# EAGLE design PIC32_BREAKOUT (EAGLE 7.5.0)
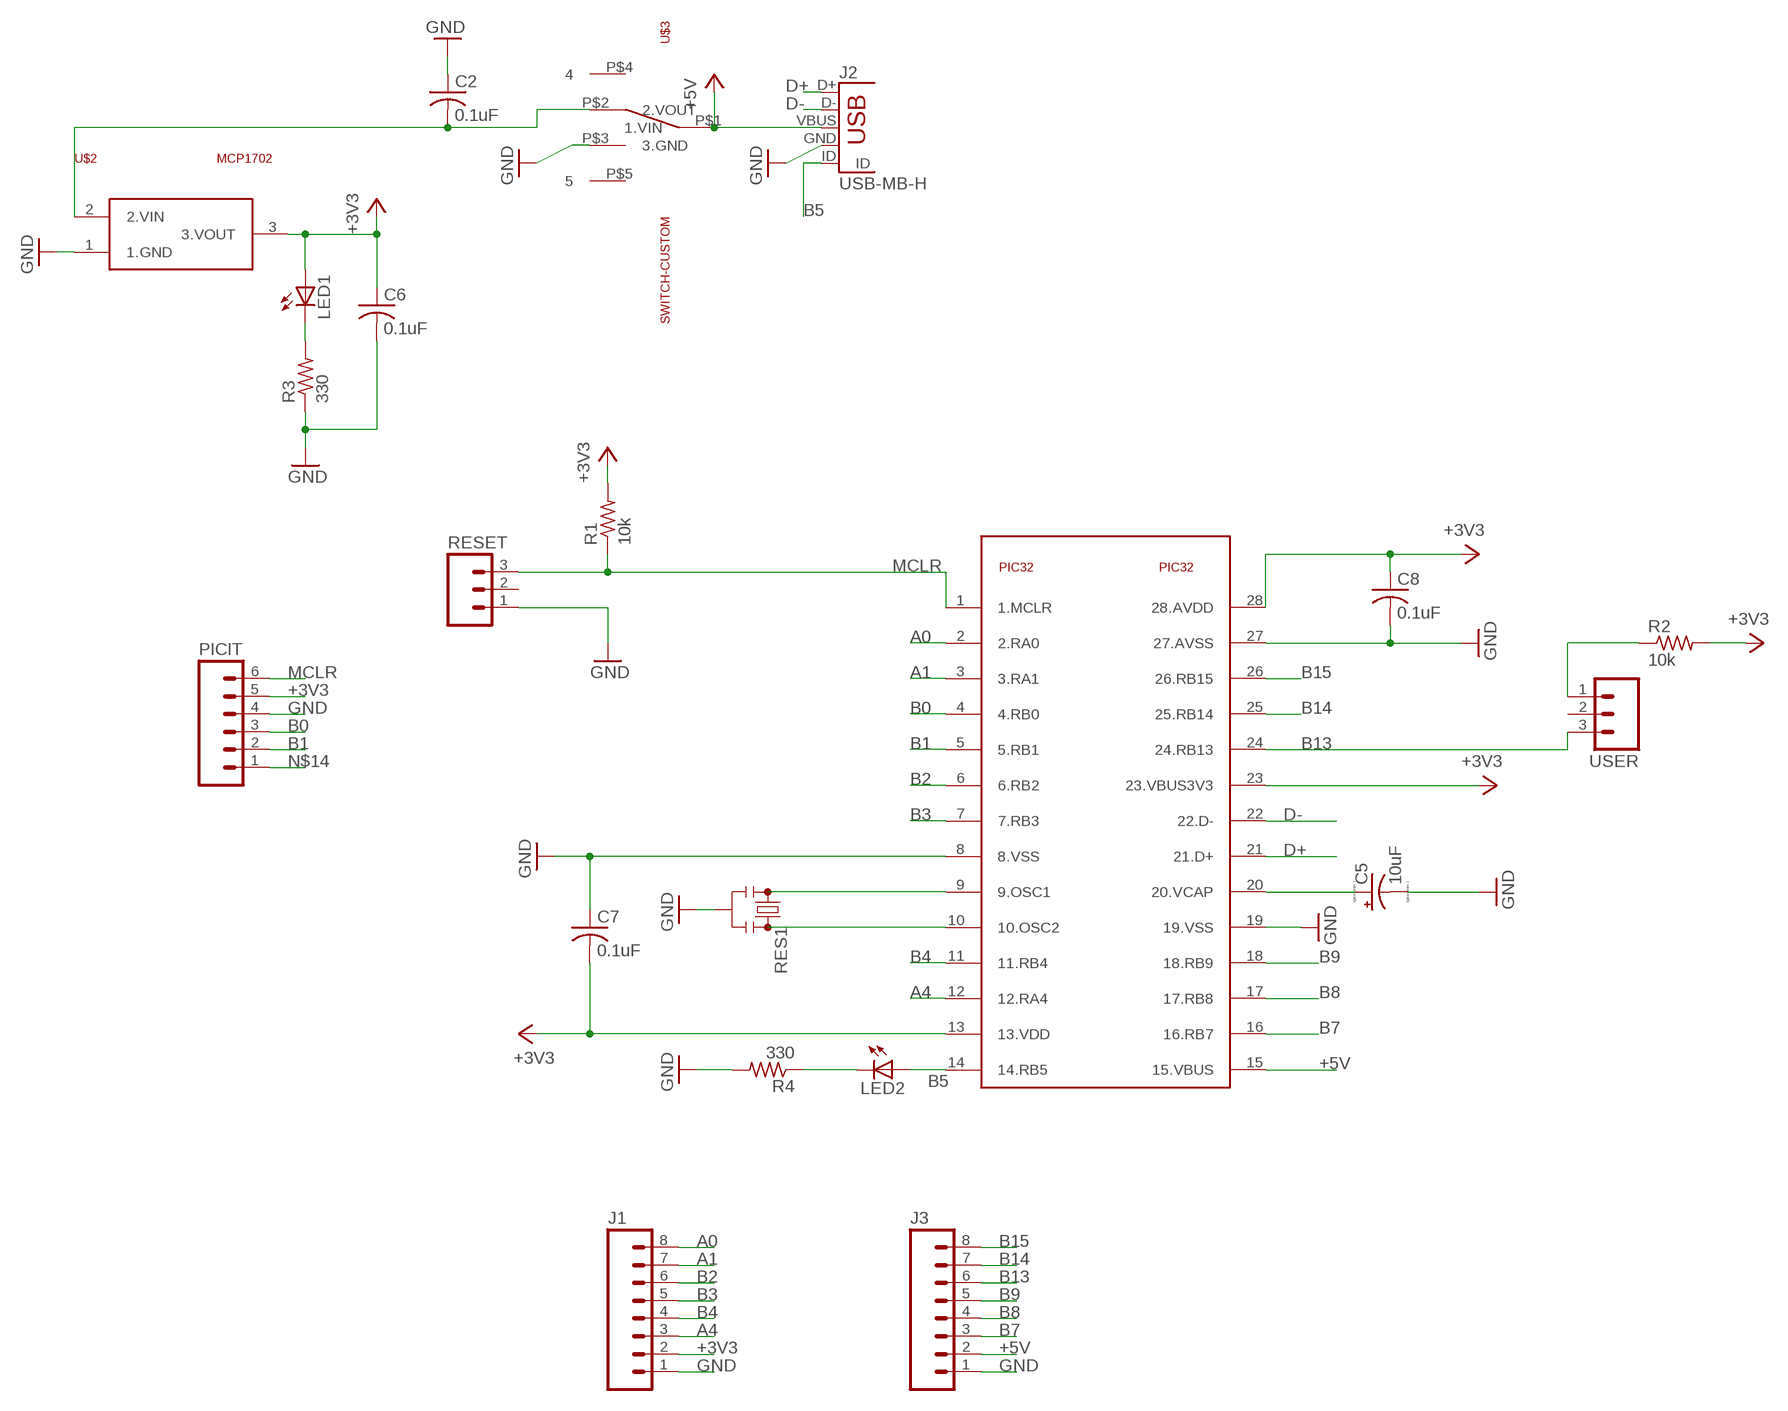
[diagram p0: schematic, sheet 1]

## Parts
C2  0.1uF  C-US025-024X044  [C025-024X044]
C5  10uF  CPOL-USB45181A  [B45181A]
C6  0.1uF  C-US025-024X044  [C025-024X044]
C7  0.1uF  C-US025-024X044  [C025-024X044]
C8  0.1uF  C-US025-024X044  [C025-024X044]
J1  M08  [1X08_ROUND]
J2  USB-MB-H  [USB-MB-H]
J3  M08  [1X08_ROUND]
LED1  LED3MM  [LED3MM]
LED2  LED3MM  [LED3MM]
PIC32  PIC32  [DIL28-3]
PICIT  M06SILK_FEMALE_PTH  [1X06]
R1  10k  R-US_0204/7  [0204/7]
R2  10k  R-US_0204/7  [0204/7]
R3  330  R-US_0204/7  [0204/7]
R4  330  R-US_0204/7  [0204/7]
RES1  RESONATORPTH  [RESONATOR-PTH]
RESET  M03LOCK  [1X03_LOCK]
U$2  MCP1702  [TO92]
U$3  SWITCH-CUSTOM  [SWITCH-CUS-H1]
USER  M03LOCK  [1X03_LOCK]

## Nets
+3V3: C6.1 C7.2 C8.1 J1.2 LED1.A PIC32.13(13.VDD) PIC32.23(23.VBUS3V3) PIC32.28(28.AVDD) PICIT.5 R1.2 R2.2 U$2.3(3.VOUT)
+5V: J2.VBUS J3.2 PIC32.15(15.VBUS) U$3.P$1(1.VIN)
A0: J1.8 PIC32.2(2.RA0)
A1: J1.7 PIC32.3(3.RA1)
A4: J1.3 PIC32.12(12.RA4)
B0: PIC32.4(4.RB0) PICIT.3
B1: PIC32.5(5.RB1) PICIT.2
B2: J1.6 PIC32.6(6.RB2)
B3: J1.5 PIC32.7(7.RB3)
B4: J1.4 PIC32.11(11.RB4)
B5: J2.ID LED2.A PIC32.14(14.RB5)
B7: J3.3 PIC32.16(16.RB7)
B8: J3.4 PIC32.17(17.RB8)
B9: J3.5 PIC32.18(18.RB9)
B13: J3.6 PIC32.24(24.RB13) USER.3
B14: J3.7 PIC32.25(25.RB14)
B15: J3.8 PIC32.26(26.RB15)
D+: J2.D+ PIC32.21(21.D+)
D-: J2.D- PIC32.22(22.D-)
GND: C2.1 C5.- C6.2 C7.1 C8.2 J1.1 J2.GND J3.1 PIC32.8(8.VSS) PIC32.19(19.VSS) PIC32.27(27.AVSS) PICIT.4 R3.1 R4.2 RES1.2 RESET.1 U$2.1(1.GND) U$3.P$3(3.GND)
MCLR: PIC32.1(1.MCLR) PICIT.6 R1.1 RESET.3
N$1: C5.+ PIC32.20(20.VCAP)
N$2: C2.2 U$2.2(2.VIN) U$3.P$2(2.VOUT)
N$3: LED1.K(C) R3.2
N$7: LED2.K(C) R4.1
N$9: PIC32.9(9.OSC1) RES1.1
N$10: PIC32.10(10.OSC2) RES1.3
N$14: PICIT.1
N$17: R2.1 USER.1
Unconnected: RESET.2 U$3.P$4 U$3.P$5 USER.2

## Library data of the parts
C2 C6-C8 = pic32_lib:C-US: CAPACITOR, American symbol
C5 = pic32_lib:CPOL-US: POLARIZED CAPACITOR, American symbol
J1 J3 = pic32_lib:M08: Header 8 Standard 8-pin 0.1" header. Use with straight break away headers (SKU : PRT-00116), right angle break away headers (PRT-00553), swiss pins (PRT-00743), machine pins (PRT-00117), and female headers (PRT-00115).; PROD_ID: CONN-08437
J2 = pic32_lib:USB: USB Connectors USB-B-PTH is fully proven SKU : PRT-00139/CONN-08278 USB-miniB is fully proven SKU : PRT-00587 USB-A-PCB is untested. USB-A-H is throughly reviewed, but untested. Spark Fun Electronics SKU : PRT-00437 USB-B-SMT is throughly reviewed, but untested. Needs silkscreen touching up. USB-A-S has not been used/tested USB-MB-H has not been used/tested USB-MICROB has been used. CONN-09505
LED1 LED2 = pic32_lib:LED: LED OSRAM: - CHIPLED LG R971, LG N971, LY N971, LG Q971, LY Q971, LO R971, LY R971 LH N974, LH R974 LS Q976, LO Q976, LY Q976 LO Q996 - Hyper CHIPLED LW Q18S LB Q993, LB Q99A, LB R99A - SideLED LS A670, LO A670, LY A670, LG A670, LP A670 LB A673, LV A673, LT A673, LW A673 LH A674 LY A675 LS A676, LA A676, LO A676, LY A676, LW A676 LS A679, LY A679, LG A679 - Hyper Micro SIDELED® LS Y876, LA Y876, LO Y876, LY Y876 LT Y87S - SmartLED LW L88C, LW L88S LB L89C, LB L89S, LG L890 LS L89K, LO L89K, LY L89K LS L896, LA L896, LO L896, LY L896 - TOPLED LS T670, LO T670, LY T670, LG T670, LP T670 LSG T670, LSP T670, LSY T670, LOP T670, LYG T670 LG T671, LOG T671, LSG T671 LB T673, LV T673, LT T673, LW T673 LH T674 LS T676, LA T676, LO T676, LY T676, LB T676, LH T676, LSB T676, LW T676 LB T67C, LV T67C, LT T67C, LS T67K, LO T67K, LY T67K, LW E67C LS E67B, LA E67B, LO E67B, LY E67B, LB E67C, LV E67C, LT E67C LW T67C LS T679, LY T679, LG T679 LS T770, LO T770, LY T770, LG T770, LP T770 LB T773, LV T773, LT T773, LW T773 LH T774 LS E675, LA E675, LY E675, LS T675 LS T776, LA T776, LO T776, LY T776, LB T776 LHGB T686 LT T68C, LB T68C - Hyper Mini TOPLED® LB M676 - Mini TOPLED Santana® LG M470 LS M47K, LO M47K, LY M47K Source: http://www.osram.convergy.de LUXEON: - LUMILED® LXK2-PW12-R00, LXK2-PW12-S00, LXK2-PW14-U00, LXK2-PW14-V00 LXK2-PM12-R00, LXK2-PM12-S00, LXK2-PM14-U00 LXK2-PE12-Q00, LXK2-PE12-R00, LXK2-PE12-S00, LXK2-PE14-T00, LXK2-PE14-U00 LXK2-PB12-K00, LXK2-PB12-L00, LXK2-PB12-M00, LXK2-PB14-N00, LXK2-PB14-P00, LXK2-PB14-Q00 LXK2-PR12-L00, LXK2-PR12-M00, LXK2-PR14-Q00, LXK2-PR14-R00 LXK2-PD12-Q00, LXK2-PD12-R00, LXK2-PD12-S00 LXK2-PH12-R00, LXK2-PH12-S00 LXK2-PL12-P00, LXK2-PL12-Q00, LXK2-PL12-R00 Source: www.luxeon.com KINGBRIGHT: KA-3528ASYC Source: www.kingbright.com
PIC32 = pic32_lib:PIC32
PICIT = pic32_lib:M06: Header 6 Standard 6-pin 0.1" header. Use with straight break away headers (SKU : PRT-00116), right angle break away headers (PRT-00553), swiss pins (PRT-00743), machine pins (PRT-00117), and female headers (PRT-00115). Molex polarized connector foot print use with SKU : PRT-08094 with associated crimp pins and housings. NOTES ON THE VARIANTS LOCK and LOCK_LONGPADS... This footprint was designed to help hold the alignment of a through-hole component (i.e. 6-pin header) while soldering it into place. You may notice that each hole has been shifted either up or down by 0.005 of an inch from it's more standard position (which is a perfectly straight line). This slight alteration caused the pins (the squares in the middle) to touch the edges of the holes. Because they are alternating, it causes a "brace" to hold the component in place. 0.005 has proven to be the perfect amount of "off-center" position when using our standard breakaway headers. Although looks a little odd when you look at the bare footprint, once you have a header in there, the alteration is very hard to notice. Also,if you push a header all the way into place, it is covered up entirely on the bottom side. This idea of altering the position of holes to aid alignment will be further integrated into the Sparkfun Library for other footprints. It can help hold any component with 3 or more connection pins.; PROD_ID: CONN-08437
R1-R4 = pic32_lib:R-US_: RESISTOR, American symbol
RES1 = SparkFun-FreqCtrl:RESONATOR: Resonator Small SMD resonator. Used, eg, on the Arduino Pro/ Pro Mini boards. 8MHz- XTAL-08895 16MHz- XTAL-08900
RESET USER = pic32_lib:M03: Header 3 Standard 3-pin 0.1" header. Use with straight break away headers (SKU : PRT-00116), right angle break away headers (PRT-00553), swiss pins (PRT-00743), machine pins (PRT-00117), and female headers (PRT-00115). Molex polarized connector foot print use with SKU : PRT-08232 with associated crimp pins and housings.
U$2 = pic32_lib:MCP1702
U$3 = pic32_lib:SWITCH-CUSTOM

## Board
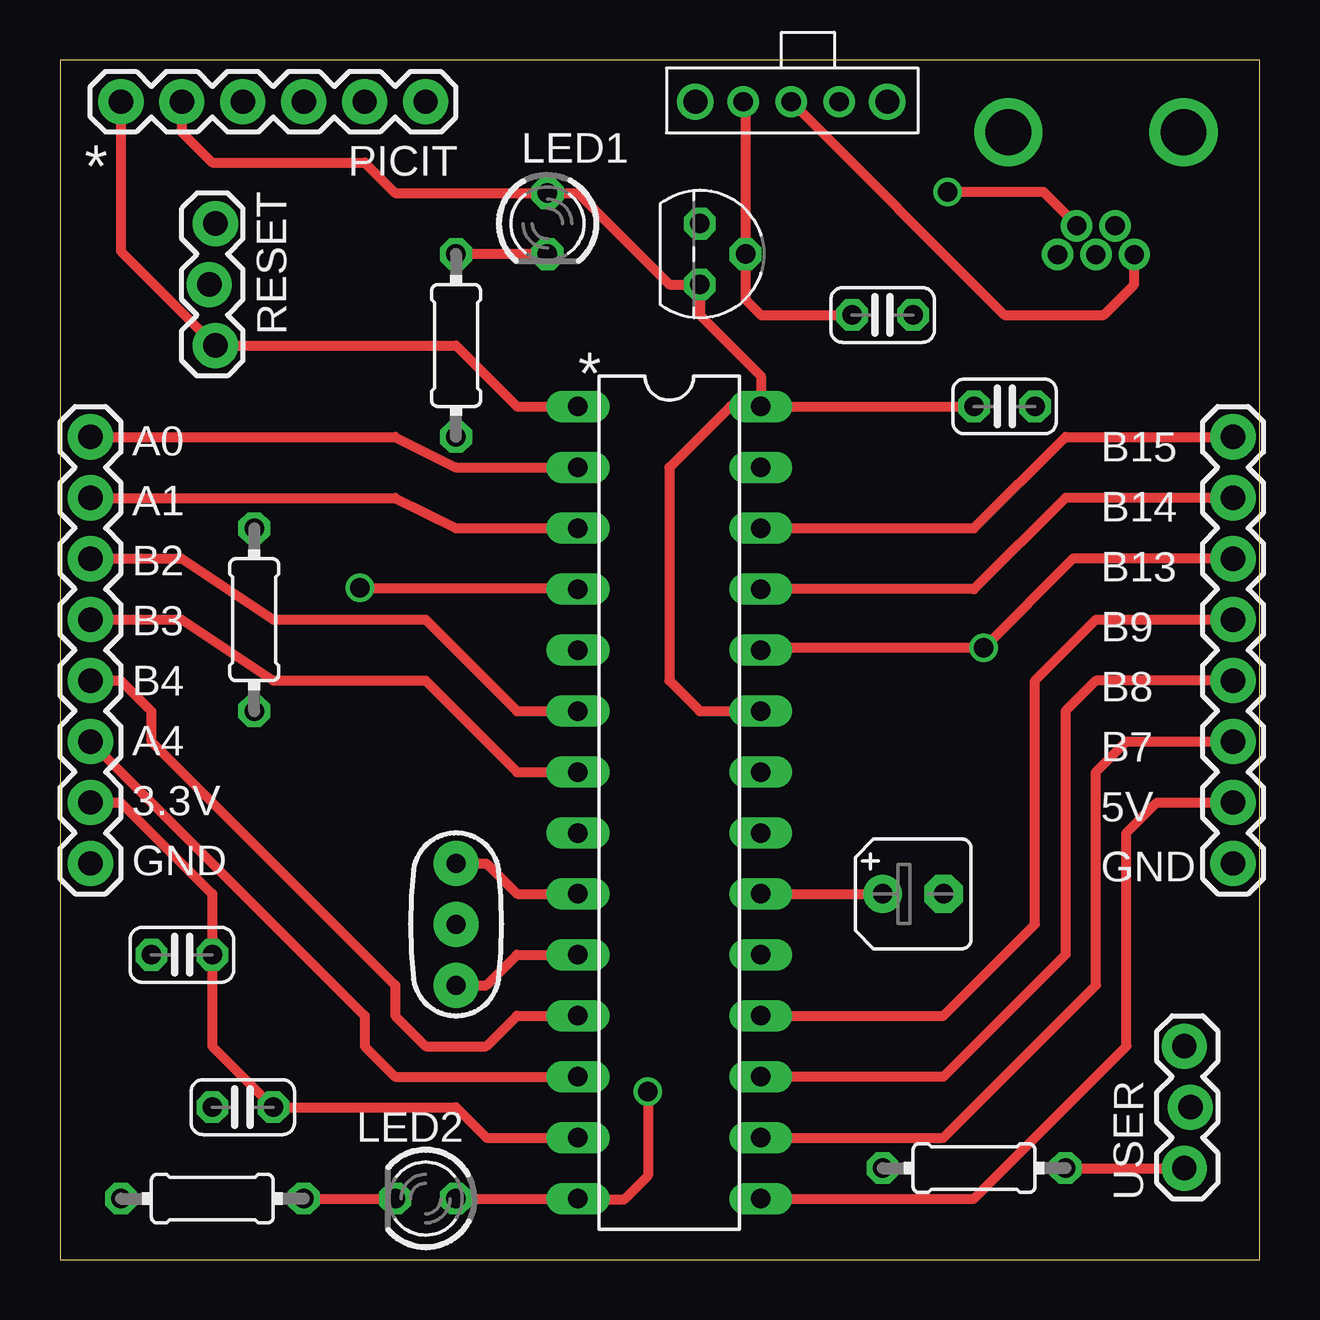
[diagram p1: board, top side]
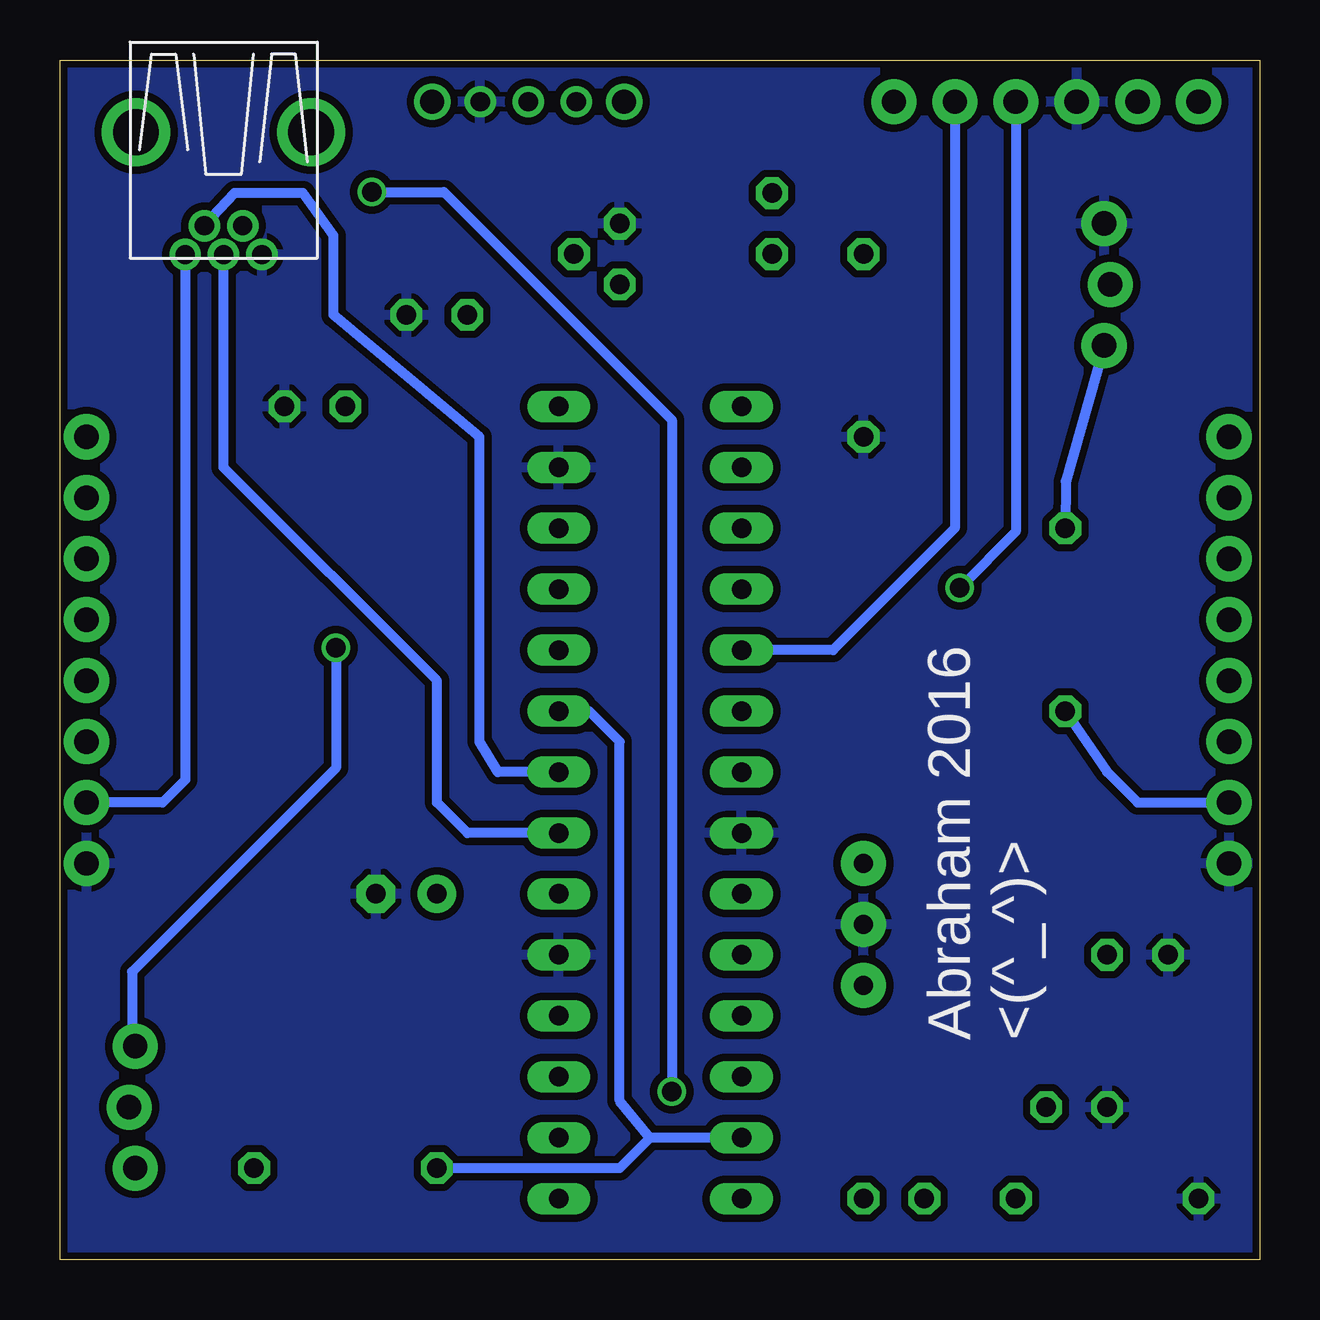
[diagram p2: board, bottom side, seen from below]

Size 50 x 50 mm. Coordinates in mm from the lower left corner, seen from the top.
Outline: 0,0 50,0 50,50 0,50 0,0
Copper layers (1*16): Top 0.035mm / dielectric 1.5mm / Bottom 0.035mm
Design rules "SeeedStudio_rule_no_angle_090911": minimum track width 6mil, minimum drill 12mil, track to track 6mil, track to pad 6mil, pad to pad 6mil, via to via 6mil, smd to smd 0mil, copper to edge 10mil, drill to drill 10mil, minimum pad ring 10mil, minimum via ring 6mil, stop-mask expansion 2mil, vias tented up to drill 100mil, thermal gap 10mil

### Footprints (pad centres in the part's own frame; a part is rotated, then mirrored left to right if it is on the bottom)
C025-024X044 = drill 0.813 octagon: 1 -1.27,0; 2 1.27,0
B45181A = drill 0.813 pad 1.6: + -1.27,0 | drill 0.813 pad 1.6 octagon: - 1.27,0
1X08_ROUND = drill 1.016 pad 1.88: 1 0,0; 2 2.54,0; 3 5.08,0; 4 7.62,0; 5 10.16,0; 6 12.7,0; 7 15.24,0; 8 17.78,0
USB-MB-H = drill 0.8: D+ 5.1,0; D- 3.9,0.8; GND 5.1,-1.6; ID 3.9,-0.8; VBUS 5.1,1.6 | drill 1.9: P$6 0,-3.65; P$7 0,3.65
LED3MM = drill 0.813 octagon: A -1.27,0; K 1.27,0
DIL28-3 = drill 0.813 long: 1 -16.51,-3.81; 2 -13.97,-3.81; 3 -11.43,-3.81; 4 -8.89,-3.81; 5 -6.35,-3.81; 6 -3.81,-3.81; 7 -1.27,-3.81; 8 1.27,-3.81; 9 3.81,-3.81; 10 6.35,-3.81; 11 8.89,-3.81; 12 11.43,-3.81; 13 13.97,-3.81; 14 16.51,-3.81; 15 16.51,3.81; 16 13.97,3.81; 17 11.43,3.81; 18 8.89,3.81; 19 6.35,3.81; 20 3.81,3.81; 21 1.27,3.81; 22 -1.27,3.81; 23 -3.81,3.81; 24 -6.35,3.81; 25 -8.89,3.81; 26 -11.43,3.81; 27 -13.97,3.81; 28 -16.51,3.81
1X06 = drill 1.016 pad 1.88: 1 0,0; 2 2.54,0; 3 5.08,0; 4 7.62,0; 5 10.16,0; 6 12.7,0
0204/7 = drill 0.813 octagon: 1 -3.81,0; 2 3.81,0
RESONATOR-PTH = drill 0.8 pad 1.88: 1 -2.54,0; 2 0,0; 3 2.54,0
1X03_LOCK = drill 1.016 pad 1.88: 1 0,0.127; 2 2.54,-0.127; 3 5.08,0.127
TO92 = drill 0.813 octagon: 1 -1.27,0; 2 0,1.905; 3 1.27,0
SWITCH-CUS-H1 = drill 0.8: P$1 0,0; P$2 -2,0; P$3 2,0 | drill 1: P$4 4,0; P$5 -4,0

### Placement (x,y rotation side)
C2  34.29,39.37 180 top
C5  35.56,15.24 0 top
C6  7.62,6.35 180 top
C7  5.08,12.7 0 top
C8  39.37,35.56 0 top
J1  1.27,16.51 90 top
J2  43.18,46.99 270 top
J3  48.9,16.51 90 top
LED1  20.32,43.18 270 top
LED2  15.24,2.54 180 top
PIC32  25.4,19.05 270 top
PICIT  15.24,48.26 180 top
R1  8.1,26.67 270 top
R2  38.1,3.81 180 top
R3  16.51,38.1 90 top
R4  6.35,2.54 180 top
RES1  16.51,13.97 270 top
RESET  6.35,43.18 270 top
U$2  26.67,41.91 270 top
U$3  30.48,48.26 0 top
USER  46.99,3.81 90 top

### Tracks (layer width: path | path; a pad name or v marks a point on that pad's centre or on a via)
+3V3
  Top 0.406: J1.2 2.54,19.05 6.35,15.24 C7.2 6.35,8.89 C6.1 16.51,6.35 17.78,5.08 PIC32.13 | PIC32.28 C8.1 | PICIT.5 5.08,46.99 6.35,45.72 12.7,45.72 13.97,44.45 LED1.A 21.59,44.45 25.4,40.64 U$2.3 26.67,39.37 29.21,36.83 PIC32.28 | PIC32.28 27.94,35.56 25.4,33.02 25.4,24.13 26.67,22.86 PIC32.23
  Bottom 0.406: R1.2 6.35,20.32 5.08,19.05 J1.2 | PIC32.13 25.4,5.08 | 25.4,5.08 26.67,3.81 R2.2 | 25.4,5.08 26.67,6.62 26.67,21.59 27.94,22.86 PIC32.23
+5V
  Top 0.406: PIC32.15 38.1,2.54 44.45,8.89 44.45,17.78 45.72,19.05 J3.2 | U$3.P$1 39.37,39.37 43.51,39.37 44.78,40.64 J2.VBUS
  Bottom 0.406: J2.VBUS 44.78,19.99 45.72,19.05 J3.2
A0
  Top 0.406: J1.8 13.97,34.29 16.51,33.02 PIC32.2
A1
  Top 0.406: J1.7 13.97,31.75 16.51,30.48 PIC32.3
A4
  Top 0.406: J1.3 12.7,10.16 12.7,8.89 13.97,7.62 PIC32.12
B0  (via drill 0.8)
  Top 0.406: v12.5,28 21.53,28 PIC32.4
  Bottom 0.406: PICIT.3 10.16,30.34 v12.5,28
B1
  Bottom 0.406: PICIT.2 12.7,30.48 17.78,25.4 PIC32.5
B2
  Top 0.406: J1.6 5.08,29.21 8.89,26.67 15.24,26.67 19.05,22.86 PIC32.6
B3
  Top 0.406: J1.5 5.08,26.67 8.89,24.13 15.24,24.13 19.05,20.32 PIC32.7
B4
  Top 0.406: J1.4 2.54,24.13 3.81,22.86 3.81,21.59 13.97,11.43 13.97,10.16 15.24,8.89 17.78,8.89 19.05,10.16 PIC32.11
B5  (via drill 0.8)
  Top 0.406: LED2.A PIC32.14 21.63,2.5 23.5,2.5 24.5,3.5 v24.5,7 | J2.ID 42.38,43.12 41,44.5 v37,44.5
  Bottom 0.406: v37,44.5 34,44.5 24.5,35 v24.5,7
B7
  Top 0.406: PIC32.16 36.83,5.08 43.18,11.43 43.18,20.32 44.45,21.59 J3.3
B8
  Top 0.406: J3.4 43.18,24.13 41.91,22.86 41.91,12.7 36.83,7.62 PIC32.17
B9
  Top 0.406: PIC32.18 36.83,10.16 40.64,13.97 40.64,24.13 43.18,26.67 J3.5
B13  (via drill 0.8)
  Top 0.406: J3.6 42.21,29.21 v38.5,25.5 29.31,25.5 PIC32.24
  Bottom 0.406: v38.5,25.5 38.5,20.5 47,12 47,9.03 USER.3
B14
  Top 0.406: J3.7 41.91,31.75 38.1,27.94 PIC32.25
B15
  Top 0.406: PIC32.26 38.1,30.48 41.91,34.29 J3.8
D+
  Bottom 0.406: PIC32.21 33.02,17.78 34.29,19.05 34.29,24.13 43.18,33.02 J2.D+
D-
  Bottom 0.406: PIC32.22 31.75,20.32 32.52,21.59 32.52,34.29 38.6,39.37 38.6,42.68 39.87,44.45 42.72,44.45 J2.D-
GND
  pour Bottom (isolate 0.305): 0,0 50.8,0 50.8,50.8 0,50.8
MCLR
  Top 0.406: PICIT.6 2.54,42.04 RESET.3 16.51,38.1 19.05,35.56 PIC32.1
  Bottom 0.406: RESET.3 8.08,32.44 R1.1
N$1
  Top 0.406: PIC32.20 C5.+
N$2
  Top 0.406: C2.2 29.21,39.37 28.57,40.01 U$2.2 28.57,48.16 U$3.P$2
N$3
  Top 0.406: LED1.K R3.2
N$7
  Top 0.406: R4.1 LED2.K
N$9
  Top 0.406: RES1.1 17.78,16.51 19.05,15.24 PIC32.9
N$10
  Top 0.406: RES1.3 17.78,11.43 19.05,12.7 PIC32.10
N$17
  Top 0.406: R2.1 USER.1

### Text on the board
tPlace: * | * | A0 | B15 | A1 | B14 | B2 | B13 | B3 | B9 | B4 | B8 | A4 | B7 | 3.3V | 5V | GND | GND
bPlace: Abraham 2016 / <(^_^)>